# EasyEDA Pro project C4主板.eprj

# Board PCB1
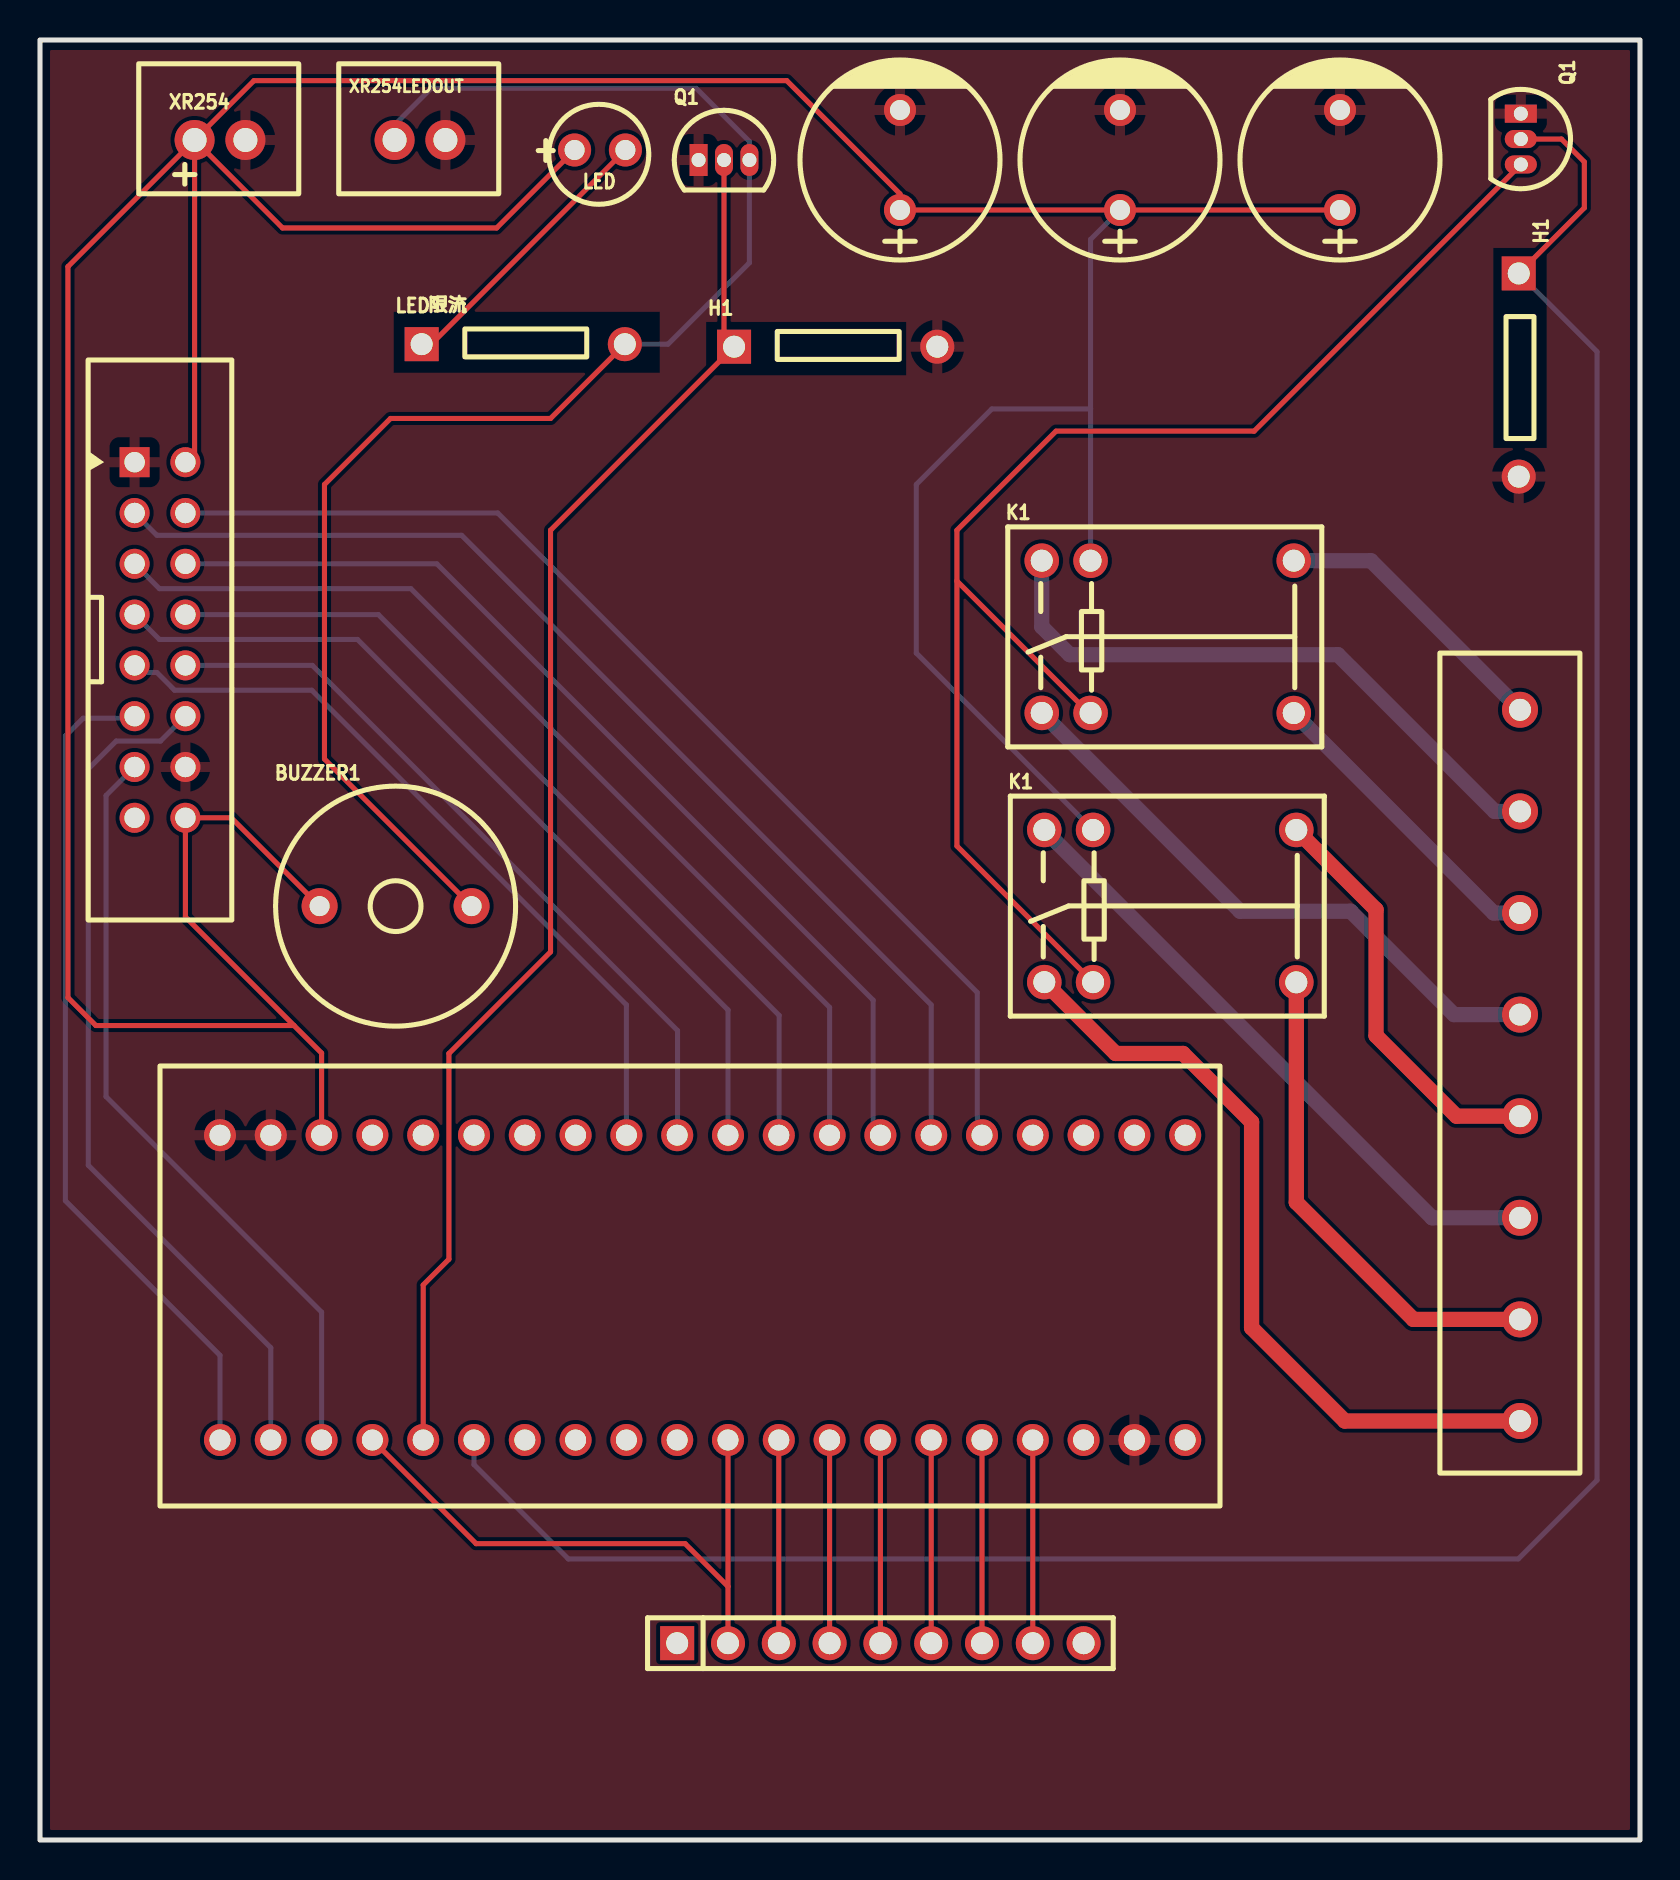
[diagram p0: board, top side]
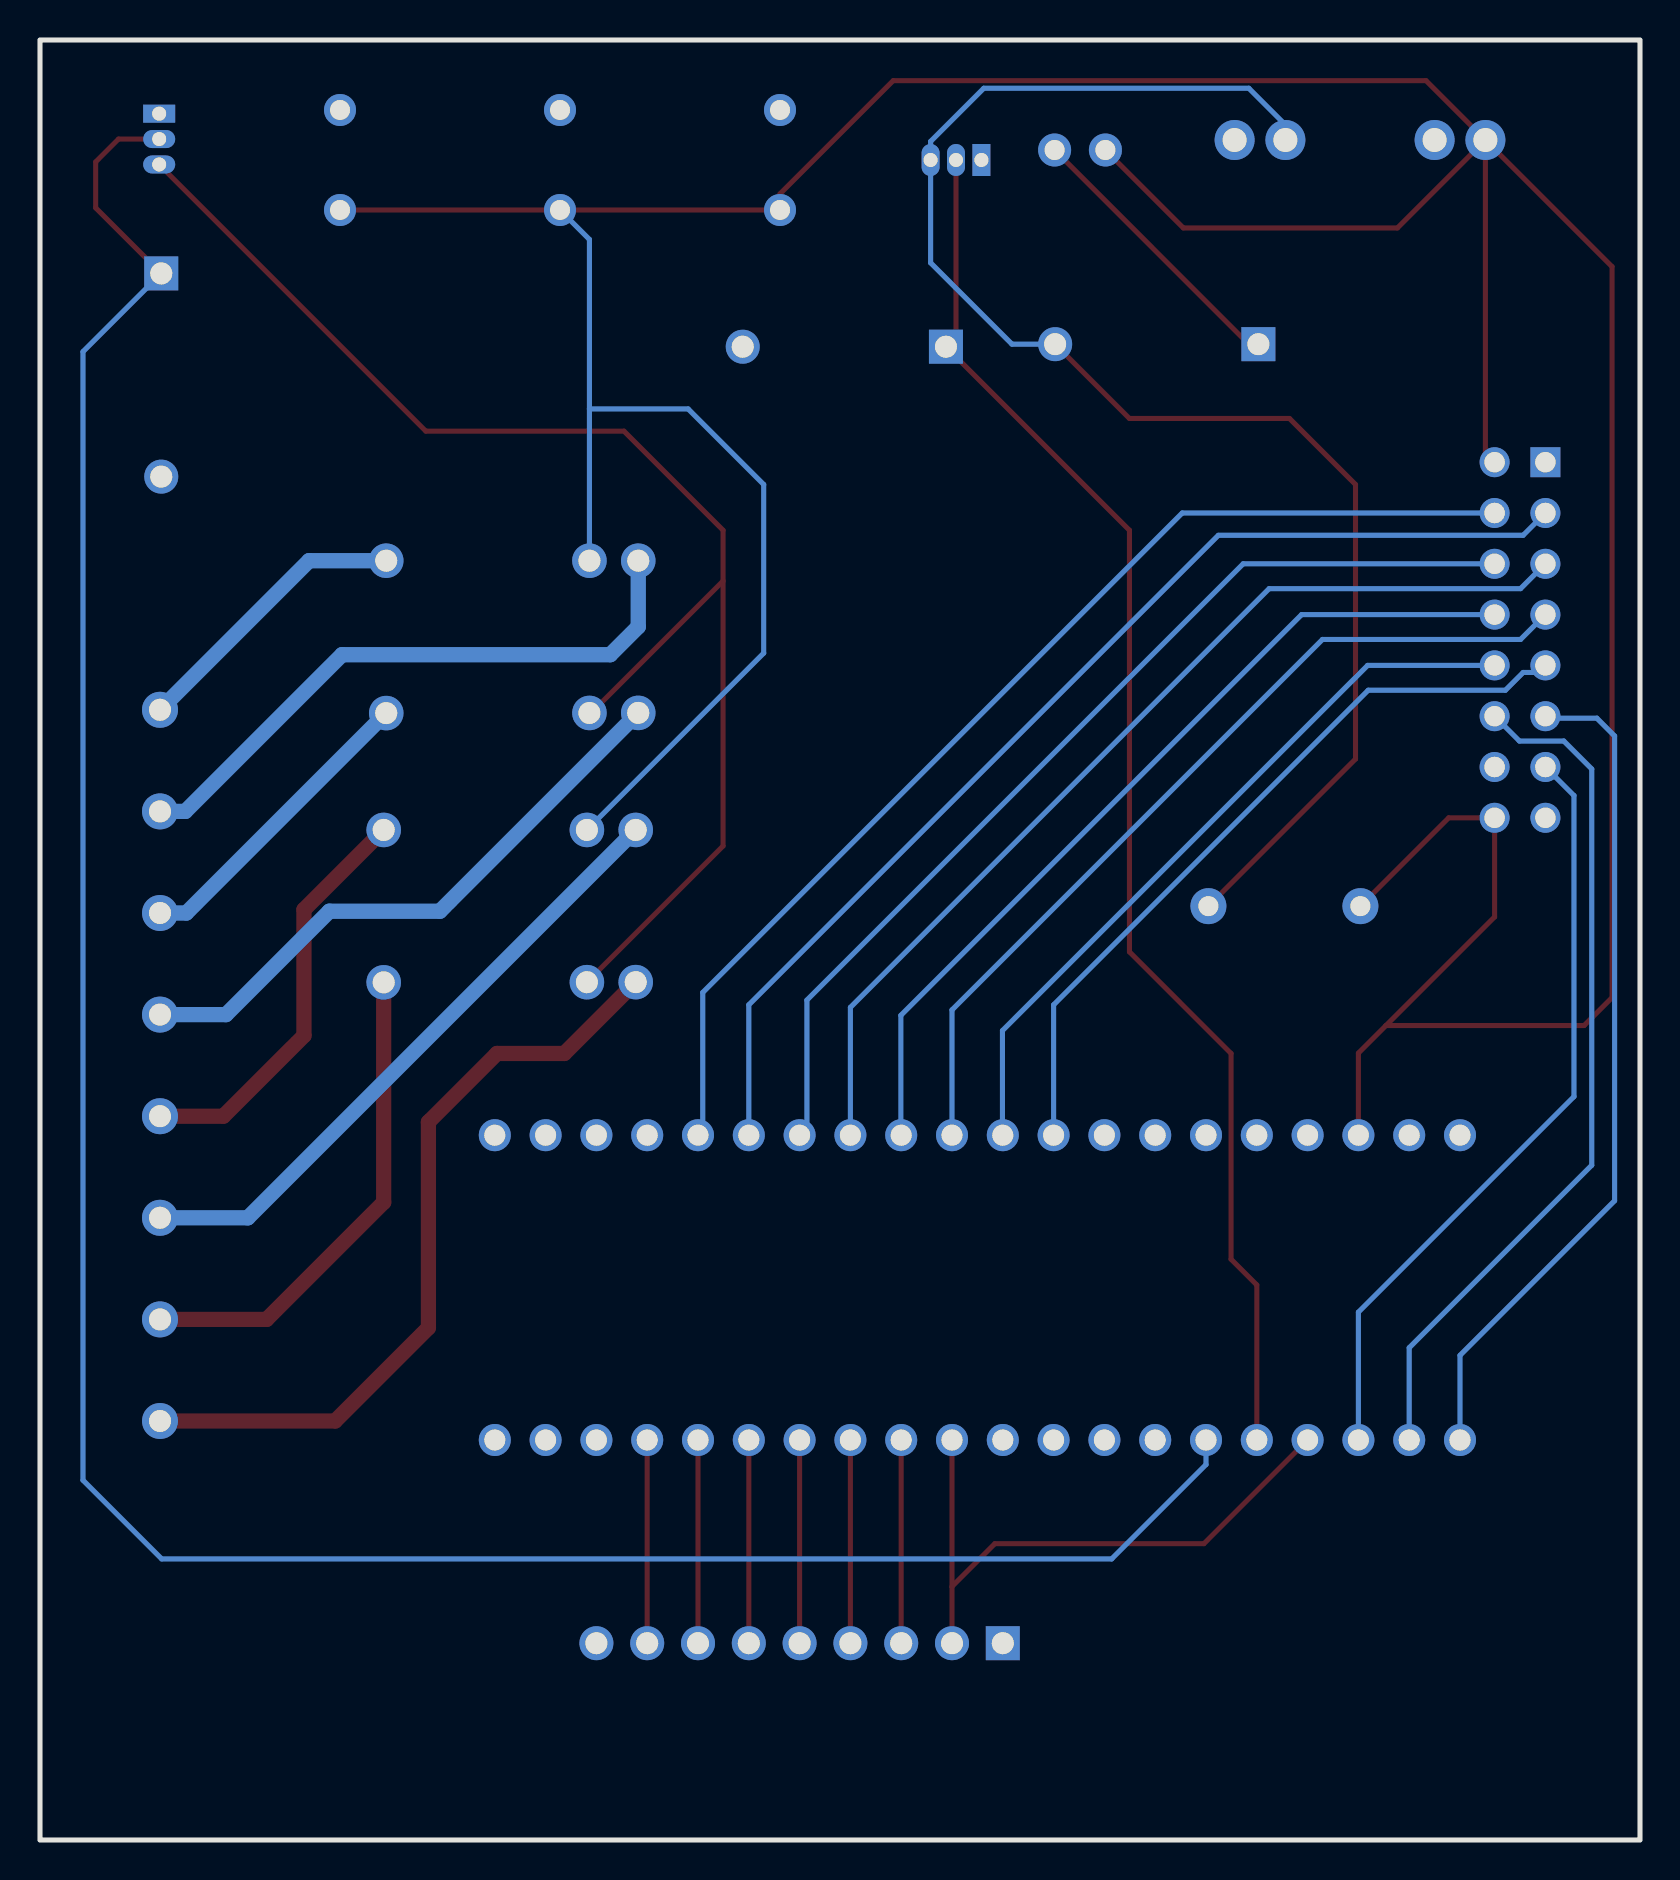
[diagram p1: board, bottom side, seen from below]

Outline 80 x 90 mm; copper layers: Top Layer, Bottom Layer. Coordinates in mm from the lower left corner of the outline.
Outline path: rectangle 0,90 80,0
Stack: Top Layer 0.035mm / Dielectric1 1.51mm FR4 er 4.5 / Bottom Layer 0.035mm

## Design rules (mm)
template: JLCPCB Capability(Two Layers Board)
spacing copperThickness1oz (default): track to track 0.102, other pairs 0.152 to 0.3
spacing copperThickness2oz: track to track 0.203, other pairs 0.152 to 0.3
track width copperThickness1oz (default): min 0.127, default 0.254, max 2.54
track width copperThickness2oz: min 0.203, default 0.254, max 2.54
differential pair differentialPair (default): width min 0.127, default 0.254, max 2.54; gap min 0.152, default 0.152
via viaSize (default): diameter min 0.5, default 0.61, max 10; hole min 0.3, default 0.305, max 6.3

## Placement (name value [footprint] x y rotation side)
BUZZER1  2.7kHz  [BUZ-TH_BD12.0-P7.60-D0.6-FD]  17.78 46.69 0 top
H1  -  [hdr-th_5p-p2.54-v-m]  39.78 74.66 0 top
H1#2  -  [HDR-TH_20P-P2.54-V-M]  33.13 20 0 top
H1#3  -  [HDR-TH_20P-P2.54-V-M]  33.13 35.24 0 top
H1#4  -  [hdr-th_5p-p2.54-v-m]  73.94 73.25 270 top
H2  PZ254V-11-09P  [HDR-TH_9P-P2.54-V-M]  42.02 9.84 0 top
K1  -  [RELAY-TH_HK4100F-DC5V-SHG]  56.51 46.69 0 top
K1#2  -  [RELAY-TH_HK4100F-DC5V-SHG]  56.39 60.16 0 top
LED限流  PZ254V-11-05P  [hdr-th_5p-p2.54-v-m]  24.16 74.79 0 top
Q1  -  [TO-92-3_L4.9-W3.7-P1.27-L]  74.04 85.05 270 top
Q1#2  -  [TO-92-3_L4.9-W3.7-P1.27-L]  34.2 84 0 top
U1  ZX-PZ2.54-1-16PZZ  [HDR-TH_16P-P2.54-V-M-2]  74 40 90 top
U3  -  [CAP-TH_BD10.0-P5.00-D0.6-FD]  54 84 90 top
U3#2  -  [CAP-TH_BD10.0-P5.00-D0.6-FD]  65 84 90 top
U3#3  -  [CAP-TH_BD10.0-P5.00-D0.6-FD]  43 84 90 top
U4  LED  [LED-TH_BD4.0-P2.54-FD_RED]  28 84.5 0 top
U5  ZX-IDC2.54-2-8PZN  [IDC-TH_16P-P2.54_ZX-IDC2.54-2-8PZN]  6 60 270 top
XR254  PZ254V-11-02P  [HDR-TH_2P-P2.54-V-M]  9 85 0 top
XR254LEDOUT  PZ254V-11-02P  [HDR-TH_2P-P2.54-V-M]  19 85 0 top

## Footprints (pads in the part's own frame, mm; a bottom-side part is the same pattern mirrored in y, then rotated)
BUZ-TH_BD12.0-P7.60-D0.6-FD
  round 1.8 hole 1: 1(-3.8,0) 2(3.8,0)
CAP-TH_BD10.0-P5.00-D0.6-FD
  round 1.6 hole 1: 1(-2.5,0) 2(2.5,0)
HDR-TH_2P-P2.54-V-M
  round 2 hole 1.2: 1(-1.27,0) 2(1.27,0)
hdr-th_5p-p2.54-v-m
  rect 1.7x1.7 hole 1.1: 1(-5.08,0)
  round 1.7 hole 1.1: 5(5.08,0)
HDR-TH_9P-P2.54-V-M
  rect 1.7x1.7 hole 1.1: 1(-10.16,0)
  round 1.7 hole 1.1: 2(-7.62,0) 3(-5.08,0) 4(-2.54,0) 5(0,0) 6(2.54,0) 7(5.08,0) 8(7.62,0) 9(10.16,0)
HDR-TH_16P-P2.54-V-M-2
  round 1.8 hole 1.1: 1(-19.05,0) 3(-13.97,0) 5(-8.89,0) 7(-3.81,0) 9(1.27,0) 11(6.35,0) 13(11.43,0) 15(16.51,0)
HDR-TH_20P-P2.54-V-M
  round 1.6 hole 1.05: 1(-24.13,0) 2(-21.59,0) 3(-19.05,0) 4(-16.51,0) 5(-13.97,0) 6(-11.43,0) 7(-8.89,0) 8(-6.35,0) 9(-3.81,0) 10(-1.27,0) 11(1.27,0) 12(3.81,0) 13(6.35,0) 14(8.89,0) 15(11.43,0) 16(13.97,0) 17(16.51,0) 18(19.05,0) 19(21.59,0) 20(24.13,0)
IDC-TH_16P-P2.54_ZX-IDC2.54-2-8PZN
  rect 1.5x1.5 hole 1.02: 1(-8.89,-1.27)
  round 1.5 hole 1.02: 2(-8.89,1.27) 3(-6.35,-1.27) 4(-6.35,1.27) 5(-3.81,-1.27) 6(-3.81,1.27) 7(-1.27,-1.27) 8(-1.27,1.27) 9(1.27,-1.27) 10(1.27,1.27) 11(3.81,-1.27) 12(3.81,1.27) 13(6.35,-1.27) 14(6.35,1.27) 15(8.89,-1.27) 16(8.89,1.27)
LED-TH_BD4.0-P2.54-FD_RED
  round 1.651 hole 1: 1(-1.27,0) 2(1.27,0)
RELAY-TH_HK4100F-DC5V-SHG
  round 1.727 hole 1.1: 1(-6.301,3.81) 2(-6.301,-3.8) 3(-3.86,3.81) 4(-3.86,-3.803) 5(6.301,3.81) 5(6.301,-3.81)
TO-92-3_L4.9-W3.7-P1.27-L
  rect 0.9x1.6 hole 0.7: 1(-1.27,0)
  oval 0.9x1.6 hole 0.7: 2(0,0) 3(1.27,0)

## Nets
5: H1#2.18
33: BUZZER1.1 H1#3.3 K1.3 K1#2.3 U3.1 U3#2.1 U3#3.1 U4.1 U5.2 U5.16 XR254.1
A0: H1#3.16 U5.4
A1: H1#3.15 U5.3
A2: H1#3.14 U5.6
A3: H1#3.13 U5.5
A4: H1#3.12 U5.8
A5: H1#3.11 U5.7
A6: H1#3.10 U5.10
A7: H1#3.9 U5.9
A8: H1.1 H1#2.5 Q1#2.2
A9: H1#2.6 H1#4.1 Q1.2
A10: H1#2.7
A11: H1#2.8
A12: H1#2.9
A15: H1#2.10
B4: H1#2.12 H2.3
B5: H1#2.13 H2.4
B6: H1#2.14 H2.5
B7: H1#2.15 H2.6
B8: H1#2.16 H2.7
B9: H1#2.17 H2.8
B12: H1#2.1 U5.11
B13: H1#2.2 U5.12
B14: H1#2.3 U5.13
B15: H1#2.4 H1#2.11 H2.2
BUZZLED-: BUZZER1.2 LED限流.5 Q1#2.3 XR254LEDOUT.1
G: H1.5 H1#2.19 H1#3.1 H1#3.2 H1#4.5 Q1.1 Q1#2.1 U3.2 U3#2.2 U3#3.2 U5.1 U5.14 XR254.2 XR254LEDOUT.2
JDQ-: K1.4 K1#2.4 Q1.3
K: U5.15
LED-: LED限流.1 U4.2

Pads without a net: H1#2 20; H1#3 4 5 6 7 8 17 18 19 20; H2 1 9; K1 1 2 5; K1#2 1 2 5; U1 1 3 5 7 9 11 13 15

## Routing (per net, layer and track width the routed paths; a pad name or vN(x,y) marks a point on that pad's centre or on a via; arc(x,y) is an arc through that point)
(no net): length 207.7
  Top Layer w0.762: U1.3 68.67,26.03 62.82,31.88 K1.5 ; K1.2 53.78,39.33 57.15,39.33 60.58,35.9 60.58,25.61 65.24,20.95 U1.1 ; K1.5 66.8,46.52 66.8,40.22 70.83,36.19 U1.7 ; 73.66,56.85 U1.15
  Bottom Layer w0.762: U1.9 70.7,41.27 65.53,46.44 60,46.44 K1#2.2 ; U1.13 72.73,51.43 64.9,59.27 51.48,59.27 50.09,60.66 K1#2.1 ; U1.15 66.54,63.97 K1#2.5 ; U1.11 72.68,46.35 K1#2.5 ; K1.1 69.61,31.11 U1.5
33: length 234.4
  Top Layer w0.254: U4.1 22.83,80.6 12.13,80.6 XR254.1 ; U3#2.1 U3.1 U3#3.1 43,82.31 37.34,87.97 10.7,87.97 XR254.1 ; BUZZER1.1 9.56,51.11 U5.16 7.27,46.15 12.7,40.72 ; 12.7,40.72 2.79,40.72 1.4,42.12 1.4,78.67 XR254.1 ; 12.7,40.72 14.08,39.34 H1#3.3 ; XR254.1 7.73,69.35 U5.2
  Bottom Layer w0.254: K1.3 43.81,59.34 43.81,67.78 47.59,71.55 52.53,71.55 ; 52.53,71.55 K1#2.3 ; 52.53,71.55 52.53,80.03 U3.1
A0: length 56.8
  Bottom Layer w0.254: H1#3.16 46.86,35.48 46.86,42.38 22.89,66.35 U5.4
A1: length 56.5
  Bottom Layer w0.254: H1#3.15 44.56,41.76 21.08,65.23 5.84,65.23 U5.3
A2: length 50.3
  Bottom Layer w0.254: U5.6 19.84,63.81 41.66,41.99 41.66,35.6 H1#3.14
A3: length 50.3
  Bottom Layer w0.254: U5.5 5.97,62.57 18.54,62.57 39.48,41.63 H1#3.13
A4: length 44
  Bottom Layer w0.254: U5.8 16.92,61.27 36.96,41.23 36.96,35.26 H1#3.12
A5: length 44.1
  Bottom Layer w0.254: U5.7 5.97,60.03 15.88,60.03 34.4,41.5 H1#3.11
A6: length 37.4
  Bottom Layer w0.254: U5.10 13.62,58.73 31.88,40.47 31.88,35.26 H1#3.10
A7: length 38.1
  Bottom Layer w0.254: H1#3.9 29.32,41.76 13.59,57.49 6.73,57.49 5.84,58.38 5.08,58.38 U5.9
A8: length 70.6
  Top Layer w0.254: H1#2.5 19.16,27.75 20.45,29.04 20.45,39.33 25.53,44.41 25.53,65.49 34.7,74.66 34.2,75.17 Q1#2.2
A9: length 133.5
  Top Layer w0.254: H1#4.1 77.22,81.61 77.22,83.9 76.07,85.05 Q1.2
  Bottom Layer w0.254: H1#2.6 21.7,18.77 26.42,14.05 73.91,14.05 77.85,17.99 77.85,74.42 H1#4.1
B4: length 10.2
  Top Layer w0.254: H1#2.12 H2.3
B5: length 10.2
  Top Layer w0.254: H2.4 H1#2.13
B6: length 10.2
  Top Layer w0.254: H1#2.14 H2.5
B7: length 10.2
  Top Layer w0.254: H2.6 H1#2.15
B8: length 10.2
  Top Layer w0.254: H1#2.16 H2.7
B9: length 10.2
  Top Layer w0.254: H1#2.17 H2.8
B12: length 42.3
  Bottom Layer w0.254: U5.11 4.63,56.09 2.16,56.09 1.27,55.2 1.27,31.96 9,24.23 H1#2.1
B13: length 43.3
  Bottom Layer w0.254: H1#2.2 11.54,24.61 2.41,33.74 2.41,53.55 3.81,54.95 6.03,54.95 U5.12
B14: length 38.7
  Bottom Layer w0.254: H1#2.3 14.08,26.39 3.3,37.17 3.3,52.22 U5.13
B15: length 31
  Top Layer w0.254: 34.4,12.67 H1#2.11 ; 34.4,12.67 H2.2 ; 34.4,12.67 32.26,14.82 21.8,14.82 H1#2.4
BUZZLED-: length 76.4
  Top Layer w0.254: BUZZER1.2 14.22,54.05 14.22,67.78 17.53,71.08 25.53,71.08 LED限流.5
  Bottom Layer w0.254: LED限流.5 31.4,74.79 35.47,78.86 Q1#2.3 35.47,84.93 32.81,87.59 19.56,87.59 17.73,85.76 XR254LEDOUT.1
JDQ-: length 70.6
  Top Layer w0.254: 45.85,62.95 52.44,56.35 K1#2.4 ; 45.85,62.95 45.85,49.7 K1.4 ; 45.85,62.95 45.85,65.49 50.8,70.44 60.71,70.44 Q1.3
LED-: length 14.2
  Top Layer w0.254: LED限流.1 19.56,74.79 U4.2

## Copper pours and planes (outline as drawn; the poured copper is in the pictures)
G on Top Layer: 0,90 80,90 80,0 0,0

## Text on the board
Top Silkscreen Layer: LED
